# Altium schematic sheet HDMI_CONN_POWER_IN.SchDoc
size C; CompanyName: Atom Computing; Organization: Altium Limited; Address1: 918 Parker St.; Address2: Suite A-13; Address3: Berkeley, CA; Address4: 94710; Revision: B.2; SheetNumber: 2; SheetTotal: 4; PageSetup: Record=PageOptions|CenterHorizontal=True|CenterVertical=True|PrintScale=1.09|XCorrection=1.00|YCorrection=1.00|PrintKind=1|BorderSize=5000000|LeftOffset=0|BottomOffset=0|Orientation=2|PaperLength=4318|PaperWidth=2794|Scale=100|PaperSource=1025|PrintQuality=600|MediaType=256|DitherType=0|PrintScaleMode=1|PaperKind=11" x 17"|PaperIndex=17; Size: C; DescriptionA: ENGINEERING RELEASE; ReleaseYear: 2024; BoardTitle: MICRO HDMI INTERFACE
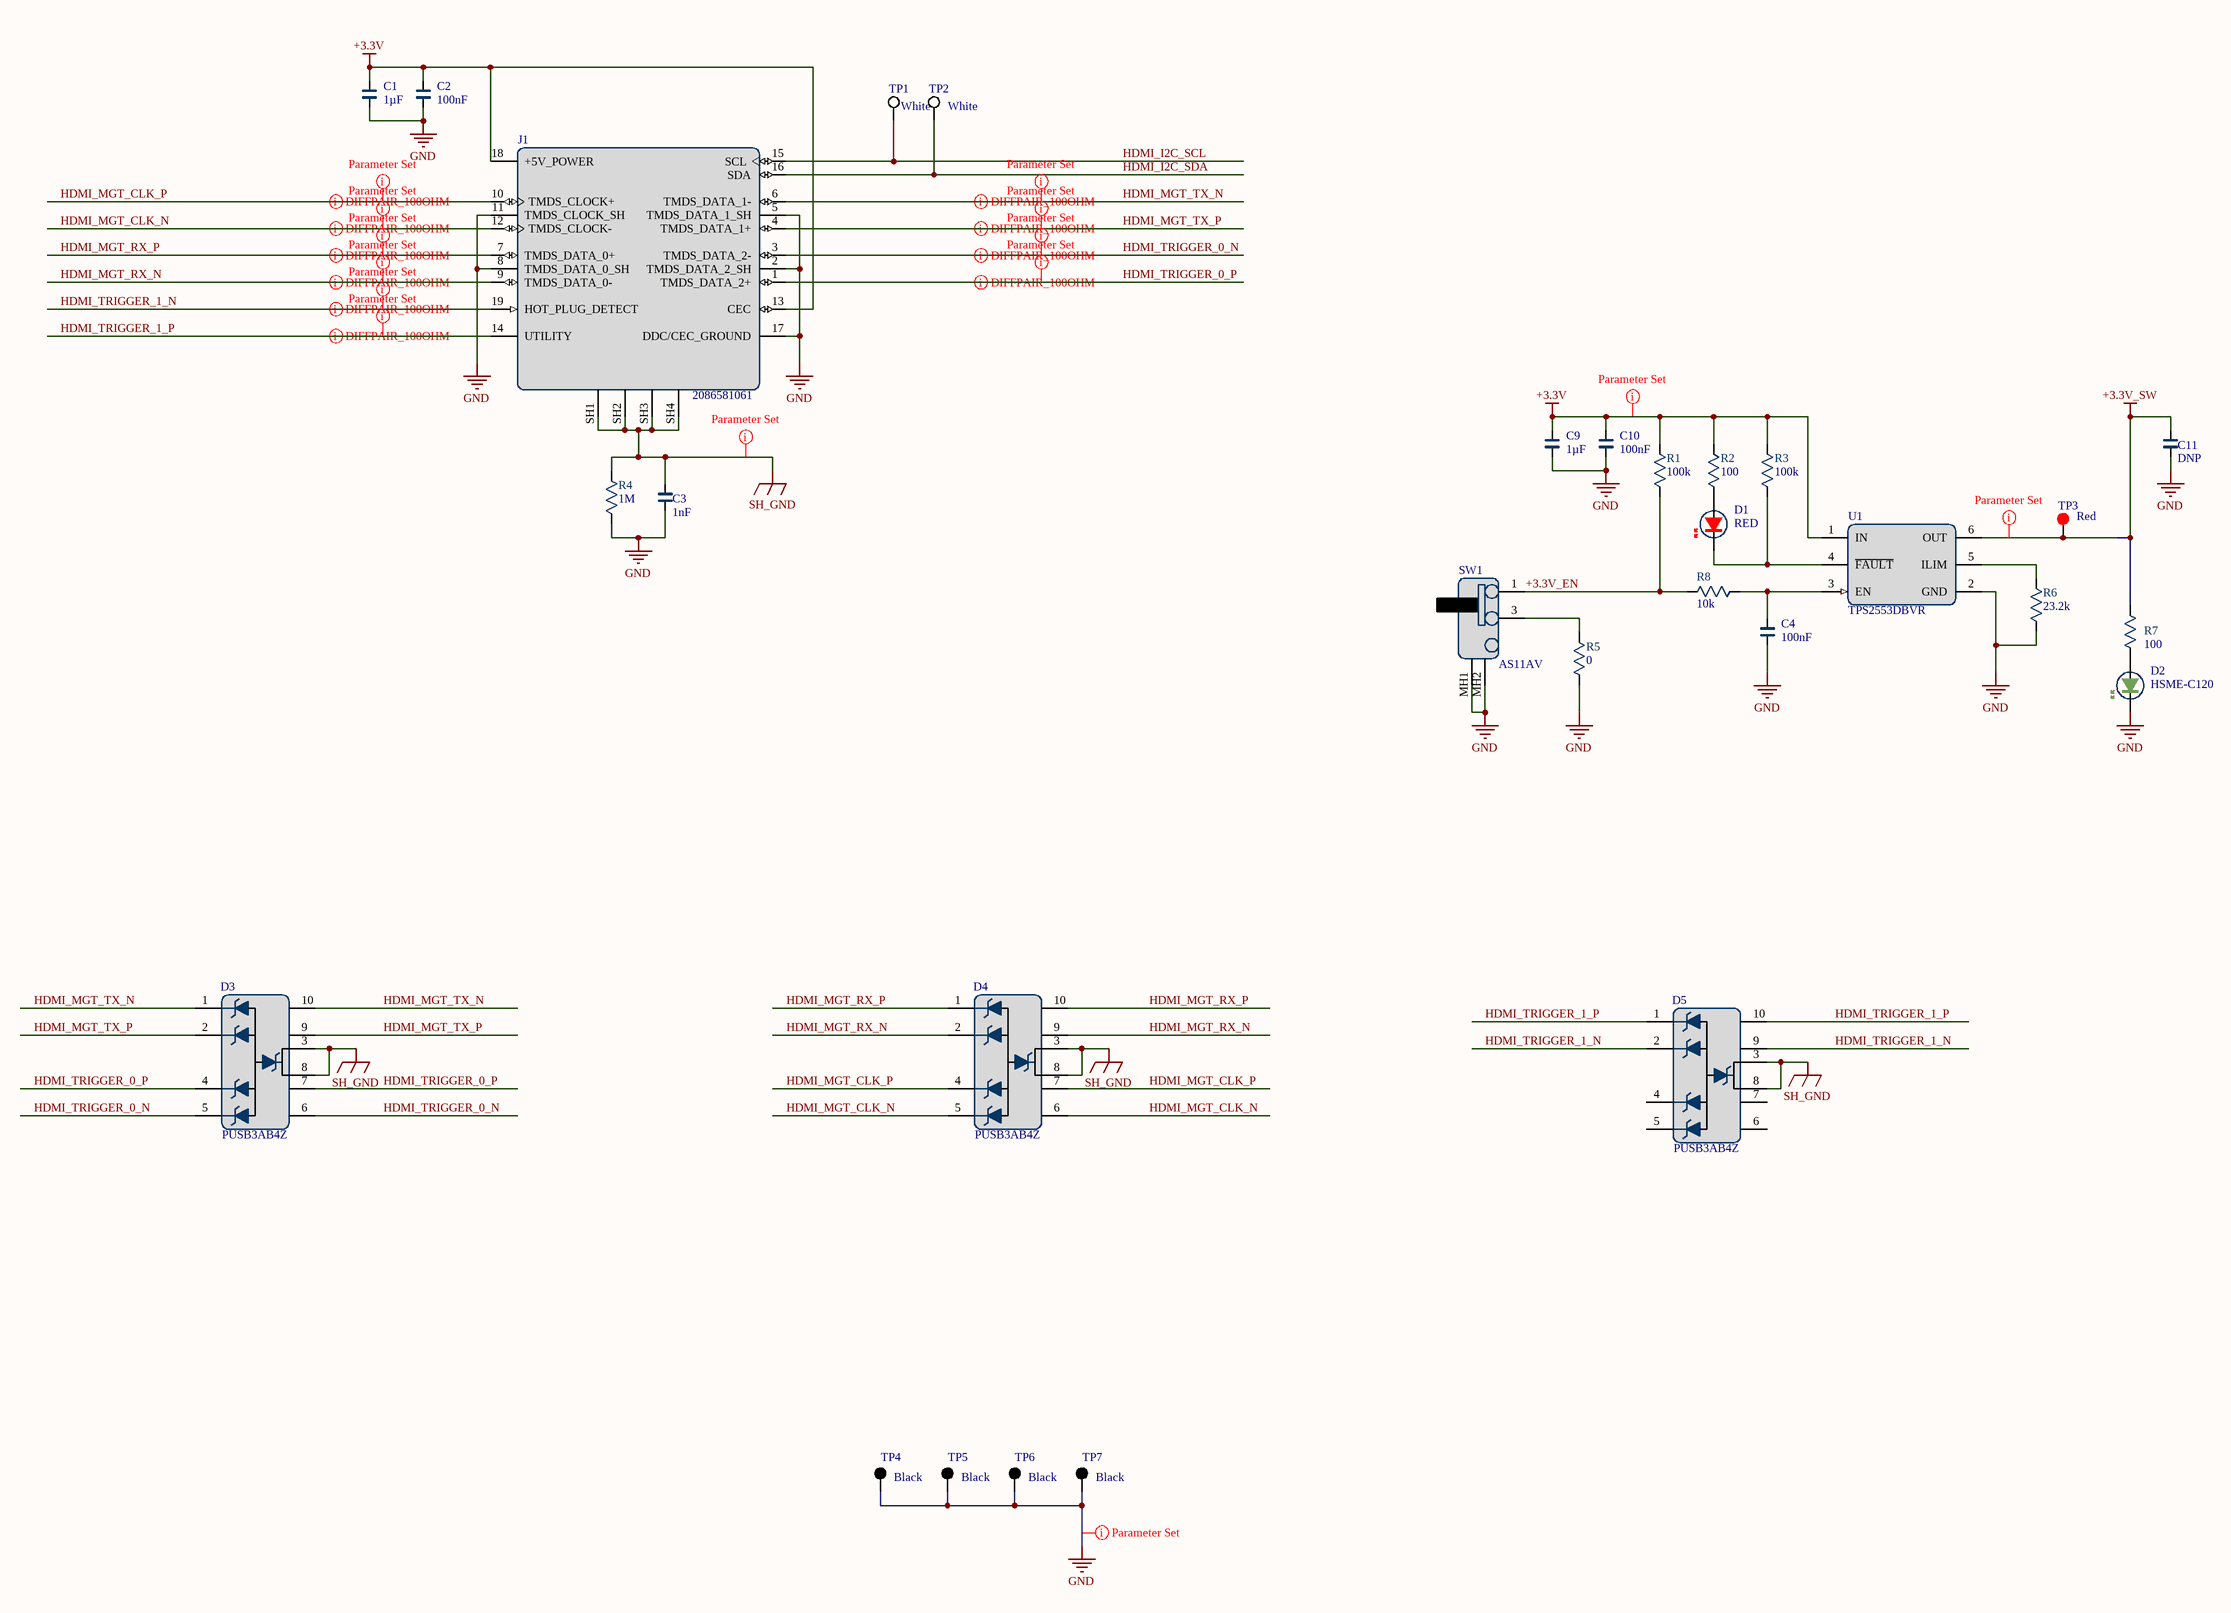
[diagram p0: HDMI_CONN_POWER_IN.SchDoc]

## Parts
C1  1µF  [CAPC160X80X95L35]
C2  100nF  [CAPC160X80X95L35]
C3  1nF  [CAPC160X80X95L35]
C4  100nF  [CAPC160X80X95L35]
C9  1µF  [CAPC160X80X95L35]
C10  100nF  [CAPC160X80X95L35]
C11  DNP  [CAPC200X125X145L50]
D1  RED  [LEDSC80X160X55L40X70_C1A2]
D2  HSME-C120  [BROADCOM_HSMX-C120]
D3  PUSB3AB4Z  [NEXPERIA_PUSB3AB4Z]
D4  PUSB3AB4Z  [NEXPERIA_PUSB3AB4Z]
D5  PUSB3AB4Z  [NEXPERIA_PUSB3AB4Z]
J1  2086581061  [MOLEX_2086581061]
R1  100k  [RESC160X85X55L30]
R2  100  [RESC160X85X55L30]
R3  100k  [RESC160X85X55L30]
R4  1M  [RESC320X160X76L51]
R5  0  [RESC160X85X55L30]
R6  23.2k  [RESC160X85X55L30]
R7  100  [RESC160X85X55L30]
R8  10k  [RESC160X85X55L30]
SW1  AS11AV  [AS11AV]
TP1  White  [Keystone_5002]
TP2  White  [Keystone_5002]
TP3  Red  [Keystone_5000]
TP4  Black  [Keystone_5001]
TP5  Black  [Keystone_5001]
TP6  Black  [Keystone_5001]
TP7  Black  [Keystone_5001]
U1  TPS2553DBVR  [SOT23-6P95_280X145L45X37]

## Nets
+3.3V: C1.1 C2.1 C9.1 C10.1 J1.13(CEC) J1.18(+5V_POWER) R1.2 R2.2 R3.2 U1.1(IN)
+3.3V_SW: C11.1 R7.2 TP3.1 U1.6(OUT)
GND: C1.2 C2.2 C3.2 C4.2 C9.2 C10.2 C11.2 D2.1 J1.2(TMDS_DATA_2_SH) J1.5(TMDS_DATA_1_SH) J1.8(TMDS_DATA_0_SH) J1.11(TMDS_CLOCK_SH) J1.17(DDC/CEC_GROUND) R4.1 R5.2 R6.1 SW1.MH1(P4) SW1.MH2(P5) TP4.1 TP5.1 TP6.1 TP7.1 U1.2(GND)
SH_GND: C3.1 D3.3 D3.8 D4.3 D4.8 D5.3 D5.8 J1.SH1(SHLD1) J1.SH2(SHLD2) J1.SH3(SHLD3) J1.SH4(SHLD4) R4.2
+3.3V_EN: R1.1 R8.1 SW1.1(P1)
HDMI_I2C_SCL: J1.15(SCL) TP1.1
HDMI_I2C_SDA: J1.16(SDA) TP2.1
HDMI_MGT_CLK_N: D4.5 D4.6 J1.12(TMDS_CLOCK-)
HDMI_MGT_CLK_P: D4.4 D4.7 J1.10(TMDS_CLOCK+)
HDMI_MGT_RX_N: D4.2 D4.9 J1.9(TMDS_DATA_0-)
HDMI_MGT_RX_P: D4.1 D4.10 J1.7(TMDS_DATA_0+)
HDMI_MGT_TX_N: D3.1 D3.10 J1.6(TMDS_DATA_1-)
HDMI_MGT_TX_P: D3.2 D3.9 J1.4(TMDS_DATA_1+)
HDMI_TRIGGER_0_N: D3.5 D3.6 J1.3(TMDS_DATA_2-)
HDMI_TRIGGER_0_P: D3.4 D3.7 J1.1(TMDS_DATA_2+)
HDMI_TRIGGER_1_N: D5.2 D5.9 J1.19(HOT_PLUG_DETECT)
HDMI_TRIGGER_1_P: D5.1 D5.10 J1.14(UTILITY)
NetC4_1: C4.1 R8.2 U1.3(EN)
NetD1_1: D1.1 R3.1 U1.4(~{FAULT})
NetD1_2: D1.2 R2.1
NetD2_2: D2.2 R7.1
NetR5_1: R5.1 SW1.3(P3)
NetR6_2: R6.2 U1.5(ILIM)

Not connected (* = marked no-connect by the designer): D5 4 5 6 7

## Layout directives
differential pair; differential pair class 100DIFF: HDMI_MGT_CLK_N, HDMI_MGT_CLK_P, HDMI_MGT_RX_N, HDMI_MGT_RX_P, HDMI_MGT_TX_N, HDMI_MGT_TX_P, HDMI_TRIGGER_0_N, HDMI_TRIGGER_0_P, HDMI_TRIGGER_1_N, HDMI_TRIGGER_1_P
net class P-G: +3.3V, +3.3V_SW, GND, SH_GND
rule Signal Stimulus [Kind - Periodic Pulse    Level - Low    Start Time = 20.00n    Stop Time = 500.0n    Period Time = 200.0n]; net class DIFFP: HDMI_MGT_CLK_P, HDMI_MGT_RX_P, HDMI_MGT_TX_P, HDMI_TRIGGER_0_P, HDMI_TRIGGER_1_P
rule Signal Stimulus [Kind - Periodic Pulse    Level - High    Start Time = 20.00n    Stop Time = 500.0n    Period Time = 200.0n]; net class DIFFN: HDMI_MGT_CLK_N, HDMI_MGT_RX_N, HDMI_MGT_TX_N, HDMI_TRIGGER_0_N, HDMI_TRIGGER_1_N

## Notes on the sheet
- SCHEMATIC,
- "This documentation describes Open Hardware and is licensed under the CC BY-SA 4.0. You may redistribute and modify this documentation under the terms of
- CC BY-SA 4.0. (https://creativecommons.org/licenses/by-sa/4.0/). This documentation is distributed WITHOUT ANY EXPRESS OR IMPLIED WARRANTY,
- INCLUDING OF MERCHANTABILITY, SATISFACTORY QUALITY AND FITNESS FOR A PARTICULAR PURPOSE."  COPYRIGHT ©
- Atom Computing, Inc.
- ,
- SIZE
- FILE NAME
- PAGE
- OF
- REV

## Library data of the parts
C1 C9 = CMP-001-00135-7: CAP CER 1uF 10V 10% 0603; Op Temp: -55°C ~ 85°C; Mfg PN: C0603C105K8PACTU; Temp Coeff: X5R; Mfg: Kemet; VALUE: 1µF; Voltage: 10V; Tolerance: 10%; Case/Package: 0603; Pins: 2
C2 C4 C10 = CMP-001-00143-7: CAP CER 0.1UF 25V X7R 0603; Tolerance: 10%; Mfg: Kemet; Mfg PN: C0603X104K3RACTU; Voltage: 25V; Temp Coeff: X7R; Case/Package: 0603; VALUE: 100nF; Pins: 2
C3 = CMP-001-00209-7: CAP CER 1000PF 50V C0G/NPO 0603; Temp Coeff: C0G/NP0; Tolerance: 5%; Mfg: Yageo; Mfg PN: CC0603JRNPO9BN102; Voltage: 50V; Case/Package: 0603; Pins: 2; VALUE: 1nF
C11 = CMP-001-00017-8: DNP, CAP 0805; VALUE: 100p; Mfg PN: DNP_CAP_0805; Mfg: DNP; Case/Package: 0805; Pins: 2
D1 = CMP-004-00024-2: LED RED CLEAR CHIP SMD 629nm, 1.9V, 0603; Mfg PN: LTST-C193KRKT-2A; Mfg: Lite-On Inc.; Current Rating: 30mA; Voltage: 2V; Op Temp: -55°C ~ 85°C; Value: RED; Pins: 2; Case/Package: 0603
D2 = CMP-004-00020-5: LED GREEN CLEAR CHIP SMD R/A; Mfg: AVAGO TECHNOLOGIES; Forward Voltage: 2.1V; Mfg PN: HSME-C120; Value: GREEN; Pins: 2; Case/Package: 2-SMD; Mounting Technology: Surface Mount; Nominal Vf: 2.1V; RoHS Compliant: Yes
D3-D5 = CMP-0037-00001-1: TVS DIODE BIDIRECTIONAL 3.3VWM 5VC DFN2510A-10; Mfg: Nexperia USA Inc.; Voltage - Clamping: 5V; Current - Peak Pulse: 7A (8/20µs); Voltage - Reverse Standoff: 3.3V; Voltage - Breakdown: 5.5V; Max Operating Temperature: 85°C; Pins: 10; Mounting Technology: Surface Mount; Mfg PN: PUSB3AB4Z; Case/Package: 10-XFDFN; RoHS Compliant: Yes; Min Operating Temperature: -40°C
J1 = CMP-002-00061-4: HDMI 2.1 Receptacle Connector 19 Position Surface Mount, Right Angle; Through Hole; Mfg: Molex; Max Current Rating: 500mA; Voltage Rating: 40V; Gender: Female; Pins: 23; RoHS Compliant: Yes; Mfg PN: 2086581061; Min Operating Temperature: -20°C; Max Operating Temperature: 85°C; Case/Package: SMD-RA; Mounting Technology: Surface Mount/Through Hole; Connector Type: HDMI
R1 = CMP-009-00291-2: RES SMD 100K OHM 1% 1/10W 0603; Mfg PN: RC0603FR-07100KL; Mfg: Yageo; Case/Package: 0603; VALUE: 100k; Pins: 2
R2 R7 = CMP-009-00467-2: RES SMD 100 OHM 1% 1/10W 0603; Mfg PN: ERJ-3EKF1000V; Mfg: Panasonic Electronic Components; Power: 100mW; VALUE: 100; Tolerance: 1%; Max Operating Temperature: 155°C; Case/Package: 0603; RoHS Compliant: Yes; Pins: 2; Min Operating Temperature: -55°C; Mounting Technology: Surface Mount
R3 = CMP-009-00291-2: RES SMD 100K OHM 1% 1/10W 0603; Mfg: Yageo; Mfg PN: RC0603FR-07100KL; Pins: 2; VALUE: 100k; Case/Package: 0603
R4 = CMP-009-00313-1: 1 ±1% 0.25W, 1/4W Chip Resistor 1206 (3216 Metric) High Voltage Thick Film; Mfg PN: RCV12061M00FKEA; Mfg: Vishay Dale; VALUE: 1M; Case/Package: 1206; Pins: 2
R5 = CMP-009-00290-2: RES 0 OHM JUMPER 1/10W 0603; Mfg PN: RC0603FR-070RL; Mfg: Yageo; Case/Package: 0603; VALUE: 0; Pins: 2
R6 = CMP-009-00553-1: RES SMD 23.2K OHM 1% 1/10W 0603; Power: 100mW; Mfg: Panasonic Electronic Components; Mfg PN: ERJ-3EKF2322V; VALUE: 23.2k; Tolerance: 1%; Pins: 2; Min Operating Temperature: -55°C; RoHS Compliant: Yes; Max Operating Temperature: 155°C; Case/Package: 0603; Mounting Technology: Surface Mount
R8 = CMP-009-00475-2: RES SMD 10K OHM 1% 1/10W 0603; Mfg: Panasonic Electronic Components; Mfg PN: ERJ-3EKF1002V; Power: 100mW; VALUE: 10k; Case/Package: 0603; RoHS Compliant: Yes; Pins: 2; Max Operating Temperature: 155°C; Min Operating Temperature: -55°C; Tolerance: 1%; Mounting Technology: Surface Mount
SW1 = CMP-011-00000-3: SWITCH SLIDE SPST 0.4VA 28V Through Hole, Right Angle, Vertical; Mfg: NKK Switches; Op Temp: -30°C ~ 85°C; Current Rating: 100mA; Pins: 3; Mfg PN: AS11AV; Case/Package: .100" TH-RA; Voltage: 28V
TP1 TP2 = CMP-00030-00002-6: Test Point, White, 1-Pin THD, RoHS, Bulk; Mfg PN: 5002; Mfg: Keystone; Pins: 1; Value: White
TP3 = CMP-00030-00000-6: Test Point, Red, 1-Pin THD, RoHS, Bulk; Mfg: Keystone; Mfg PN: 5000; Value: Red; Pins: 1
TP4-TP7 = CMP-00030-00001-5: Test Point, Black, 1-Pin THD, RoHS, Bulk; Mfg PN: 5001; Mfg: Keystone; Value: Black; Pins: 1
U1 = CMP-035-00004-3: Power Switch/Driver 1:1 N-Channel 1.5A SOT-23-6; Min Supply Voltage: 2.5V; Max Supply Voltage: 6.5V; Mfg: Texas Instruments; RoHS Compliant: Yes; Mfg PN: TPS2553DBVR; Pins: 6; Output Current: 1.5A; Mounting Technology: Surface Mount; Case/Package: SOT-23-6; Max Operating Temperature: 85°C; Min Operating Temperature: -40°C